# Altium schematic sheet mppt.SchDoc
size B
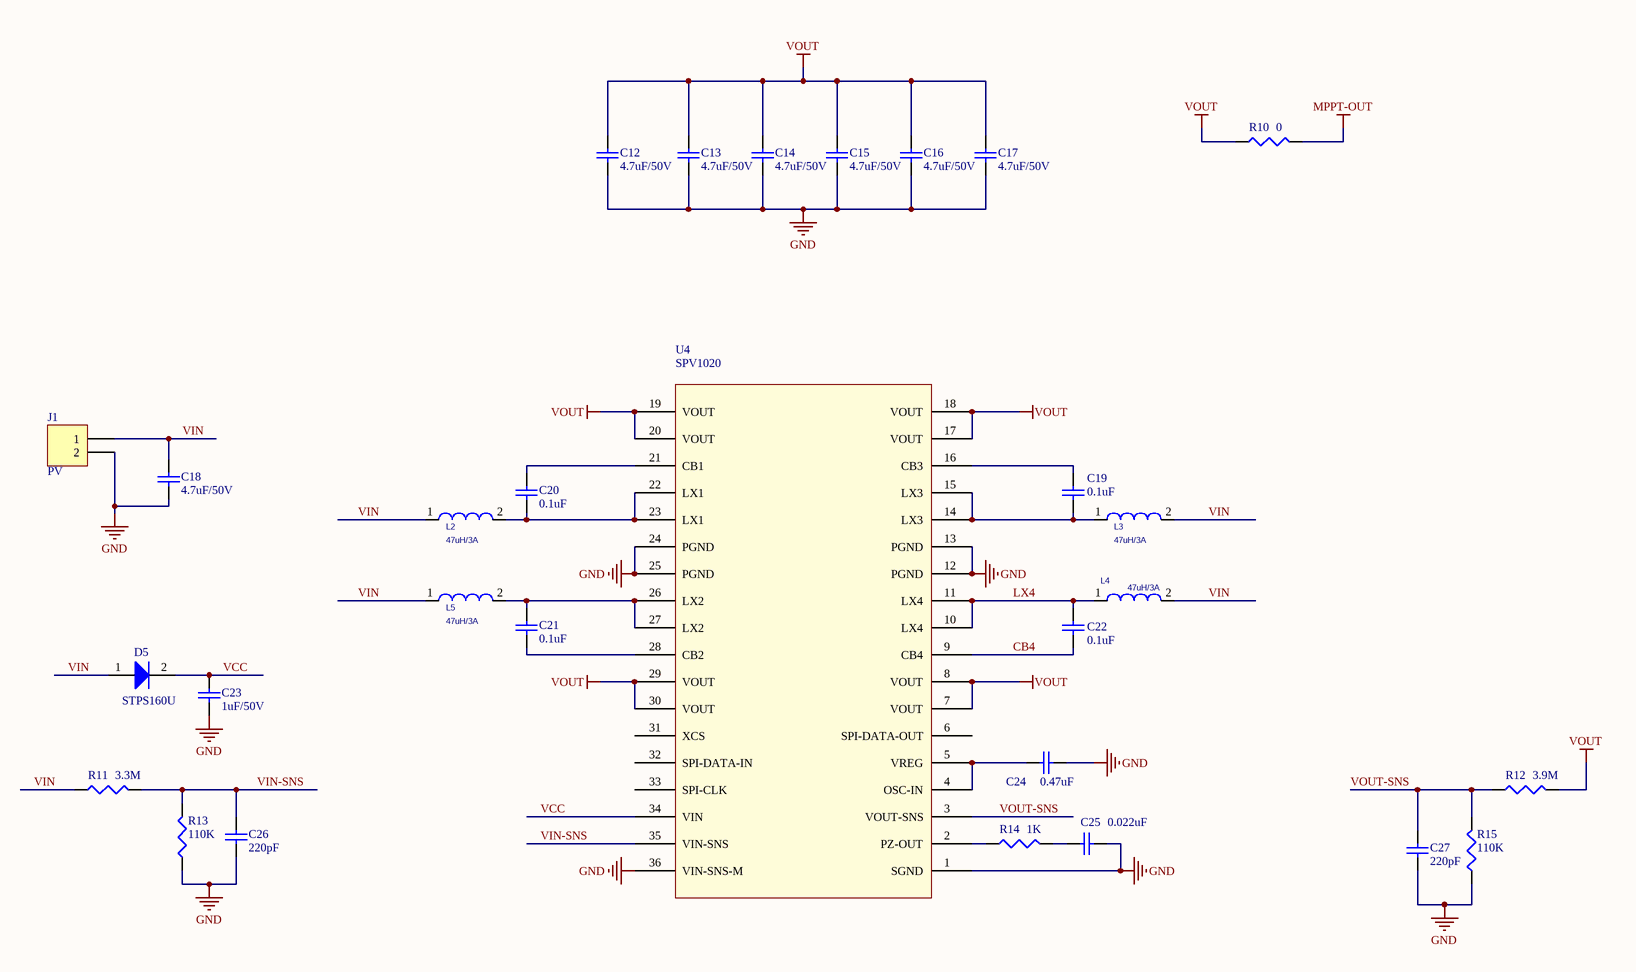
[diagram p0: mppt.SchDoc]

## Parts
C12  4.7uF/50V  [1812]
C13  4.7uF/50V  [1812]
C14  4.7uF/50V  [1812]
C15  4.7uF/50V  [1812]
C16  4.7uF/50V  [1812]
C17  4.7uF/50V  [1812]
C18  4.7uF/50V  [1812]
C19  0.1uF  [0603]
C20  0.1uF  [0603]
C21  0.1uF  [0603]
C22  0.1uF  [0603]
C23  1uF/50V  [1210]
C24  0.47uF  [0603]
C25  0.022uF  [0603]
C26  220pF  [0603]
C27  220pF  [0603]
D5  STPS160U  [B320A]
J1  PV  [T-2PIN]
L2  47uH/3A  [IND-47UH-3A]
L3  47uH/3A  [IND-47UH-3A]
L4  47uH/3A  [IND-47UH-3A]
L5  47uH/3A  [IND-47UH-3A]
R10  0  [BREAK]
R11  3.3M  [0603]
R12  3.9M  [0603]
R13  110K  [0603]
R14  1K  [0603]
R15  110K  [0603]
U4  SPV1020  [POWERSSOP36]

## Nets
GND: C12.1 C13.1 C14.1 C15.1 C16.1 C17.1 C18.1 C23.1 C24.2 C25.2 C26.1 C27.1 J1.2 R13.1 R15.1 U4.1(SGND) U4.12(PGND) U4.13(PGND) U4.24(PGND) U4.25(PGND) U4.36(VIN-SNS-M)
MPPT-OUT: R10.2
VOUT: C12.2 C13.2 C14.2 C15.2 C16.2 C17.2 R10.1 R12.2 U4.7(VOUT) U4.8(VOUT) U4.17(VOUT) U4.18(VOUT) U4.19(VOUT) U4.20(VOUT) U4.29(VOUT) U4.30(VOUT)
CB4: C22.1 U4.9(CB4)
LX4: C22.2 L4.1 U4.10(LX4) U4.11(LX4)
VCC: C23.2 D5.2(K) U4.34(VIN)
VIN: C18.2 D5.1(A) J1.1 L2.1 L3.2 L4.2 L5.1 R11.1
VIN-SNS: C26.2 R11.2 R13.2 U4.35(VIN-SNS)
VOUT-SNS: C27.2 R12.1 R15.2 U4.3(VOUT-SNS)
NetC19_1: C19.1 L3.1 U4.14(LX3) U4.15(LX3)
NetC19_2: C19.2 U4.16(CB3)
NetC20_1: C20.1 L2.2 U4.22(LX1) U4.23(LX1)
NetC20_2: C20.2 U4.21(CB1)
NetC21_1: C21.1 U4.28(CB2)
NetC21_2: C21.2 L5.2 U4.26(LX2) U4.27(LX2)
NetC24_1: C24.1 U4.4(OSC-IN) U4.5(VREG)
NetC25_1: C25.1 R14.2
NetR14_1: R14.1 U4.2(PZ-OUT)

Not connected (* = marked no-connect by the designer): U4 6(SPI-DATA-OUT) 31(XCS) 32(SPI-DATA-IN) 33(SPI-CLK)

## Library data of the parts
C12-C27 = Cap: Capacitor; Value: 100pF; Published: 8-Jun-2000; LatestRevisionDate: 17-Jul-2002; LatestRevisionNote: Re-released for DXP Platform.; PackageReference: RAD-0.3; Publisher: Altium Limited; PackageDescription: Radial Cap, Thru-Hole; 2 Leads; 0.3 in Pin Spacing
D5 = Diode: Default Diode; Published: 8-Jun-2000; LatestRevisionDate: 17-Jul-2002; LatestRevisionNote: Re-released for DXP Platform.; PackageVersion: Sep-1996; PackageReference: SMC; Publisher: Altium Limited; PackageDescription: DO-214-AB/SMC; 2 C-Bend Leads; Body 7.9 x 5.9 mm, inc. leads (LxW); Code_JEDEC: DO-214-AB
J1 = Header 2: Header, 2-Pin; LatestRevisionDate: 17-Jul-2002; LatestRevisionNote: Re-released for DXP Platform.; Publisher: Altium Limited
L2-L5 = 4.7UH_CDH2D09BNP-4R7MC_0.7A_20%: Part Number: SH00000AJ00; ROOM: +1.3V_CORE
R10-R13 R15 = Res3: Resistor; Value: 1K; Published: 8-Jun-2000; LatestRevisionDate: 29-May-2009; LatestRevisionNote: IPC-7351 Footprint Added.; PackageReference: J1-0603; Publisher: Altium Limited; PackageDescription: Chip Resistor
R14 = Res3: Resistor; Published: 8-Jun-2000; LatestRevisionDate: 29-May-2009; LatestRevisionNote: IPC-7351 Footprint Added.; PackageReference: J1-0603; Publisher: Altium Limited; PackageDescription: Chip Resistor; Value: 1K